# Altium project AKS.PrjPcb
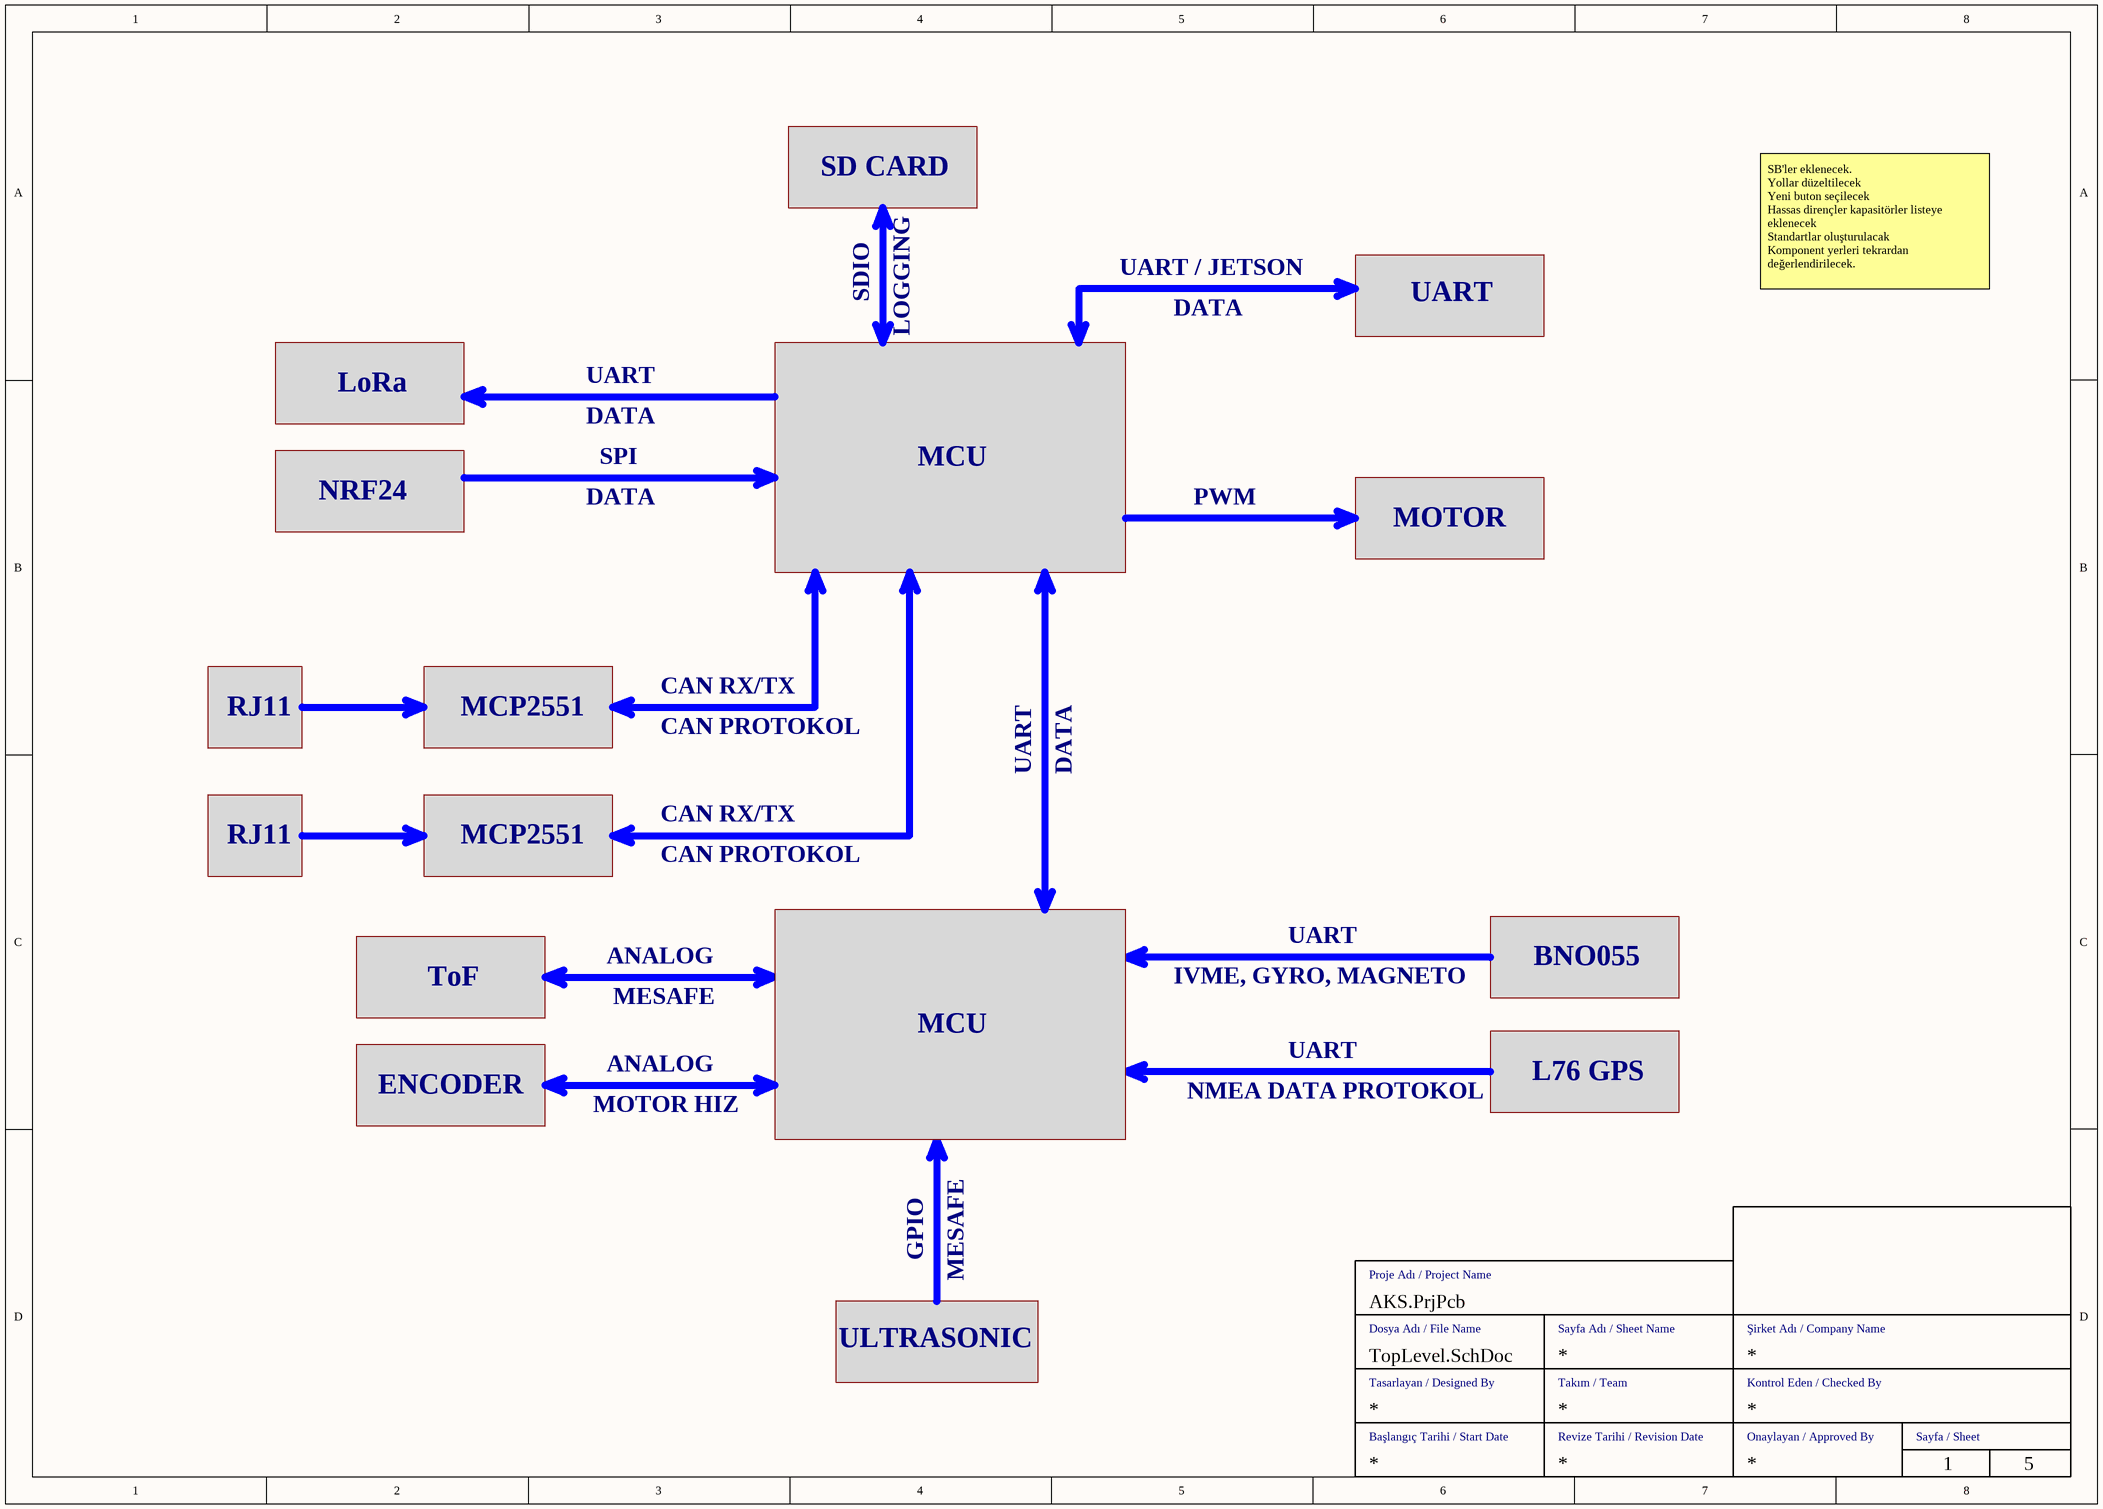
[diagram p0: TopLevel.SchDoc]
5 sheets, 106 parts. Net scope: flat (ports and power ports of the same name join across sheets).
Board file: AKS.PcbDoc
Sheets:
  TopLevel.SchDoc
  MCU.SchDoc
  Sensors.SchDoc
  Communication.SchDoc
  Power.SchDoc

## Sheet TopLevel.SchDoc
size A3; SheetNumber: 1; SheetTotal: 5

### Notes on the sheet
- SD CARD
- SDIO
- UART / JETSON
- DATA
- UART
- SB'ler eklenecek.
  Yollar düzeltilecek
  Yeni buton seçilecek
  Hassas dirençler kapasitörler listeye eklenecek
  Standartlar oluşturulacak
  Komponent yerleri tekrardan değerlendirilecek.
- LOGGING
- LoRa
- NRF24
- SPI
- MCU
- PWM
- MOTOR
- RJ11
- MCP2551
- CAN RX/TX
- CAN PROTOKOL
- ToF
- ANALOG
- IVME, GYRO, MAGNETO
- BNO055
- MESAFE
- ENCODER
- MOTOR HIZ
- NMEA DATA PROTOKOL
- L76 GPS
- GPIO
- ULTRASONIC
- Dosya Adı / File Name
- Proje Adı / Project Name
- Sayfa Adı / Sheet Name
- Şirket Adı / Company Name
- Tasarlayan / Designed By
- Takım / Team
- Kontrol Eden / Checked By
- Başlangıç Tarihi / Start Date
- Revize Tarihi / Revision Date
- Onaylayan / Approved By
- Sayfa / Sheet

## Sheet MCU.SchDoc
size A3; SheetNumber: 2; SheetTotal: 5
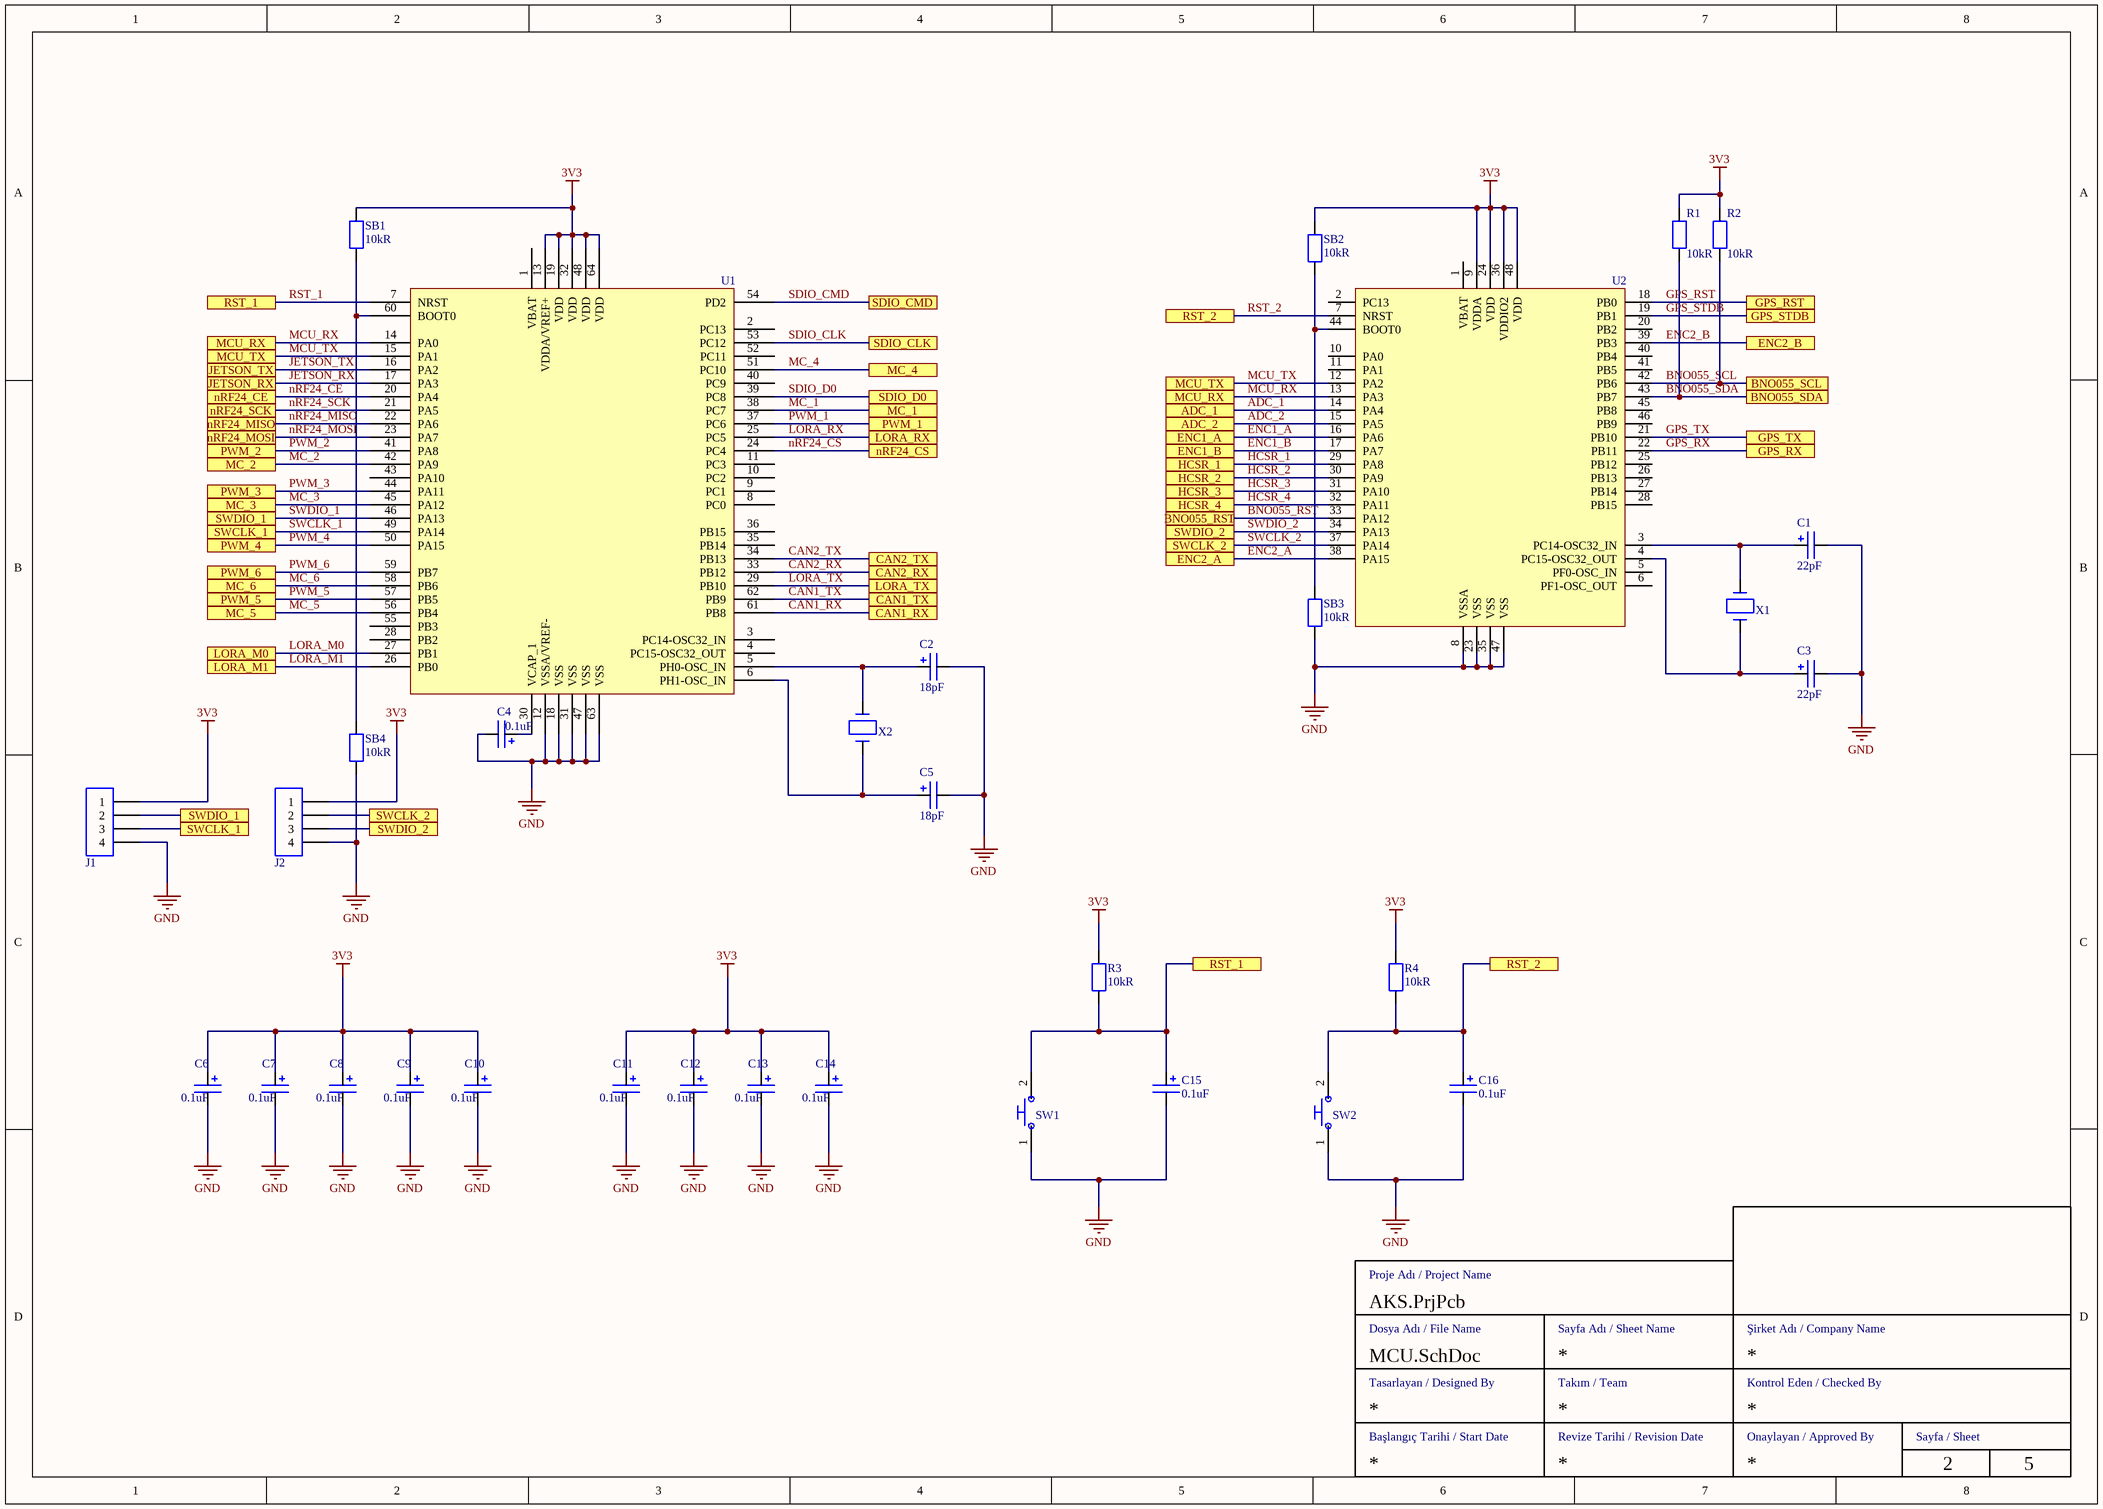
[diagram p1: MCU.SchDoc]

### Parts
C1  value 22pF  [CAP 0603]  (hidden comment: CAP 0603)
C2  value 18pF  [CAP 0603]  (hidden comment: CAP 0603)
C3  value 22pF  [CAP 0603]  (hidden comment: CAP 0603)
C4  value 0.1uF  [CAP 0603]  (hidden comment: CAP 0603)
C5  value 18pF  [CAP 0603]  (hidden comment: CAP 0603)
C6  value 0.1uF  [CAP 0603]  (hidden comment: CAP 0603)
C7  value 0.1uF  [CAP 0603]  (hidden comment: CAP 0603)
C8  value 0.1uF  [CAP 0603]  (hidden comment: CAP 0603)
C9  value 0.1uF  [CAP 0603]  (hidden comment: CAP 0603)
C10  value 0.1uF  [CAP 0603]  (hidden comment: CAP 0603)
C11  value 0.1uF  [CAP 0603]  (hidden comment: CAP 0603)
C12  value 0.1uF  [CAP 0603]  (hidden comment: CAP 0603)
C13  value 0.1uF  [CAP 0603]  (hidden comment: CAP 0603)
C14  value 0.1uF  [CAP 0603]  (hidden comment: CAP 0603)
C15  value 0.1uF  [CAP 0603]  (hidden comment: CAP 0603)
C16  value 0.1uF  [CAP 0603]  (hidden comment: CAP 0603)
J1  146285-4  [HMATHT00C41]  (value not drawn)
J2  146285-4  [HMATHT00C41]  (value not drawn)
R1  value 10kR  [RESISTOR 0603]  (hidden comment: RES 0603)
R2  value 10kR  [RESISTOR 0603]  (hidden comment: RES 0603)
R3  value 10kR  [RESISTOR 0603]  (hidden comment: RES 0603)
R4  value 10kR  [RESISTOR 0603]  (hidden comment: RES 0603)
SB1  value 10kR  [RESISTOR 0603]  (hidden comment: RES 0603)
SB2  value 10kR  [RESISTOR 0603]  (hidden comment: RES 0603)
SB3  value 10kR  [RESISTOR 0603]  (hidden comment: RES 0603)
SB4  value 10kR  [RESISTOR 0603]  (hidden comment: RES 0603)
SW1  DS1042-03  [SWITCH-6X6]  (value not drawn)
SW2  DS1042-03  [SWITCH-6X6]  (value not drawn)
U1  STM32F446xC  [LQFP64]  (value not drawn)
U2  STM32F072C8  [LQFP48]  (value not drawn)
X1  RSM200S-32.768  [4-SOJ]  (value not drawn)
X2  ABM3-8.000  [2-SMD]  (value not drawn)

### Ports
ADC_1, ADC_2, BNO055_RST, BNO055_SCL, BNO055_SDA, CAN1_RX, CAN1_TX, CAN2_RX, CAN2_TX, ENC1_A, ENC1_B, ENC2_A, ENC2_B, GPS_RST, GPS_RX, GPS_STDB, GPS_TX, HCSR_1, HCSR_2, HCSR_3, HCSR_4, JETSON_RX, JETSON_TX, LORA_M0, LORA_M1, LORA_RX, LORA_TX, MC_1, MC_2, MC_3, MC_4, MC_5, MC_6, MCU_RX, MCU_TX, nRF24_CE, nRF24_CS, nRF24_MISO, nRF24_MOSI, nRF24_SCK, PWM_1, PWM_2, PWM_3, PWM_4, PWM_5, PWM_6, RST_1, RST_2, SDIO_CLK, SDIO_CMD, SDIO_D0, SWCLK_1, SWCLK_2, SWDIO_1, SWDIO_2

### Nets
3V3: C6.1 C7.1 C8.1 C9.1 C10.1 C11.1 C12.1 C13.1 C14.1 J1.1 J2.1 R1.2 R2.2 R3.2 R4.2 SB1.2 SB2.2 U1.13(VDDA/VREF+) U1.19(VDD) U1.32(VDD) U1.48(VDD) U1.64(VDD) U2.9(VDDA) U2.24(VDD) U2.36(VDDIO2) U2.48(VDD)
GND: C1.2 C2.2 C3.2 C4.2 C5.2 C6.2 C7.2 C8.2 C9.2 C10.2 C11.2 C12.2 C13.2 C14.2 C15.2 C16.2 J1.4 J2.4 SB3.1 SB4.1 SW1.1 SW2.1 U1.12(VSSA/VREF-) U1.18(VSS) U1.31(VSS) U1.47(VSS) U1.63(VSS) U2.8(VSSA) U2.23(VSS) U2.35(VSS) U2.47(VSS)
ADC_1: U2.14(PA4) ; port ADC_1
ADC_2: U2.15(PA5) ; port ADC_2
BNO055_RST: U2.33(PA12) ; port BNO055_RST
BNO055_SCL: R2.1 U2.42(PB6) ; port BNO055_SCL
BNO055_SDA: R1.1 U2.43(PB7) ; port BNO055_SDA
CAN1_RX: U1.61(PB8) ; port CAN1_RX
CAN1_TX: U1.62(PB9) ; port CAN1_TX
CAN2_RX: U1.33(PB12) ; port CAN2_RX
CAN2_TX: U1.34(PB13) ; port CAN2_TX
ENC1_A: U2.16(PA6) ; port ENC1_A
ENC1_B: U2.17(PA7) ; port ENC1_B
ENC2_A: U2.38(PA15) ; port ENC2_A
ENC2_B: U2.39(PB3) ; port ENC2_B
GPS_RST: U2.18(PB0) ; port GPS_RST
GPS_RX: U2.22(PB11) ; port GPS_RX
GPS_STDB: U2.19(PB1) ; port GPS_STDB
GPS_TX: U2.21(PB10) ; port GPS_TX
HCSR_1: U2.29(PA8) ; port HCSR_1
HCSR_2: U2.30(PA9) ; port HCSR_2
HCSR_3: U2.31(PA10) ; port HCSR_3
HCSR_4: U2.32(PA11) ; port HCSR_4
JETSON_RX: U1.17(PA3) ; port JETSON_RX
JETSON_TX: U1.16(PA2) ; port JETSON_TX
LORA_M0: U1.27(PB1) ; port LORA_M0
LORA_M1: U1.26(PB0) ; port LORA_M1
LORA_RX: U1.25(PC5) ; port LORA_RX
LORA_TX: U1.29(PB10) ; port LORA_TX
MC_1: U1.38(PC7) ; port MC_1
MC_2: U1.42(PA9) ; port MC_2
MC_3: U1.45(PA12) ; port MC_3
MC_4: U1.51(PC10) ; port MC_4
MC_5: U1.56(PB4) ; port MC_5
MC_6: U1.58(PB6) ; port MC_6
MCU_RX: U1.14(PA0) U2.13(PA3) ; port MCU_RX
MCU_TX: U1.15(PA1) U2.12(PA2) ; port MCU_TX
nRF24_CE: U1.20(PA4) ; port nRF24_CE
nRF24_CS: U1.24(PC4) ; port nRF24_CS
nRF24_MISO: U1.22(PA6) ; port nRF24_MISO
nRF24_MOSI: U1.23(PA7) ; port nRF24_MOSI
nRF24_SCK: U1.21(PA5) ; port nRF24_SCK
PWM_1: U1.37(PC6) ; port PWM_1
PWM_2: U1.41(PA8) ; port PWM_2
PWM_3: U1.44(PA11) ; port PWM_3
PWM_4: U1.50(PA15) ; port PWM_4
PWM_5: U1.57(PB5) ; port PWM_5
PWM_6: U1.59(PB7) ; port PWM_6
RST_1: C15.1 R3.1 SW1.2 U1.7(NRST) ; port RST_1
RST_2: C16.1 R4.1 SW2.2 U2.7(NRST) ; port RST_2
SDIO_CLK: U1.53(PC12) ; port SDIO_CLK
SDIO_CMD: U1.54(PD2) ; port SDIO_CMD
SDIO_D0: U1.39(PC8) ; port SDIO_D0
SWCLK_1: J1.3 U1.49(PA14) ; port SWCLK_1
SWCLK_2: J2.2 U2.37(PA14) ; port SWCLK_2
SWDIO_1: J1.2 U1.46(PA13) ; port SWDIO_1
SWDIO_2: J2.3 U2.34(PA13) ; port SWDIO_2
NetC1_1: C1.1 U2.3(PC14-OSC32_IN) X1.1
NetC2_1: C2.1 U1.5(PH0-OSC_IN) X2.1
NetC3_1: C3.1 U2.4(PC15-OSC32_OUT) X1.4
NetC4_1: C4.1 U1.30(VCAP_1)
NetC5_1: C5.1 U1.6(PH1-OSC_IN) X2.2
NetSB1_1: SB1.1 SB4.2 U1.60(BOOT0)
NetSB2_1: SB2.1 SB3.2 U2.44(BOOT0)

Not connected (* = marked no-connect by the designer): U1 1(VBAT) 2(PC13) 3(PC14-OSC32_IN) 4(PC15-OSC32_OUT) 8(PC0) 9(PC1) 10(PC2) 11(PC3) 28(PB2) 35(PB14) 36(PB15) 40(PC9) 43(PA10) 52(PC11) 55(PB3); U2 1(VBAT) 2(PC13) 5(PF0-OSC_IN) 6(PF1-OSC_OUT) 10(PA0) 11(PA1) 20(PB2) 25(PB12) 26(PB13) 27(PB14) 28(PB15) 40(PB4) 41(PB5) 45(PB8) 46(PB9)

### Notes on the sheet
- Dosya Adı / File Name
- Proje Adı / Project Name
- Sayfa Adı / Sheet Name
- Şirket Adı / Company Name
- Tasarlayan / Designed By
- Takım / Team
- Kontrol Eden / Checked By
- Başlangıç Tarihi / Start Date
- Revize Tarihi / Revision Date
- Onaylayan / Approved By
- Sayfa / Sheet

### Library data of the parts
C1-C16 = CAP 0603: Multilayer Ceramic Capacitor; Capacitor Type: MLCC; Case/Package: 0603
J1 J2 = HMATHT00C41: Header for PCB
R1-R4 SB1-SB4 = RES 0603: SMD Chip Resistor; Case/Package: 0603
SW1 SW2 = DS1042-03: Switch
U1 = STM32F446xC: STM32 ARM Cortex M4; Case/Package: LQFP; Pins: 64; Category: MCU
U2 = STM32F072C8: STM32 ARM Cortex M0; Case/Package: LQFP; Pins: 48; Category: MCU
X1 = RSM200S-32.768: CRYSTAL; Capacitance: 12.5pF
X2 = ABM3-8.000: CRYSTAL; Frequency: 8MHz; Capacitance: 18pF; Case/Package: 2-SMD

## Sheet Sensors.SchDoc
size A4; SheetNumber: 3; SheetTotal: 5
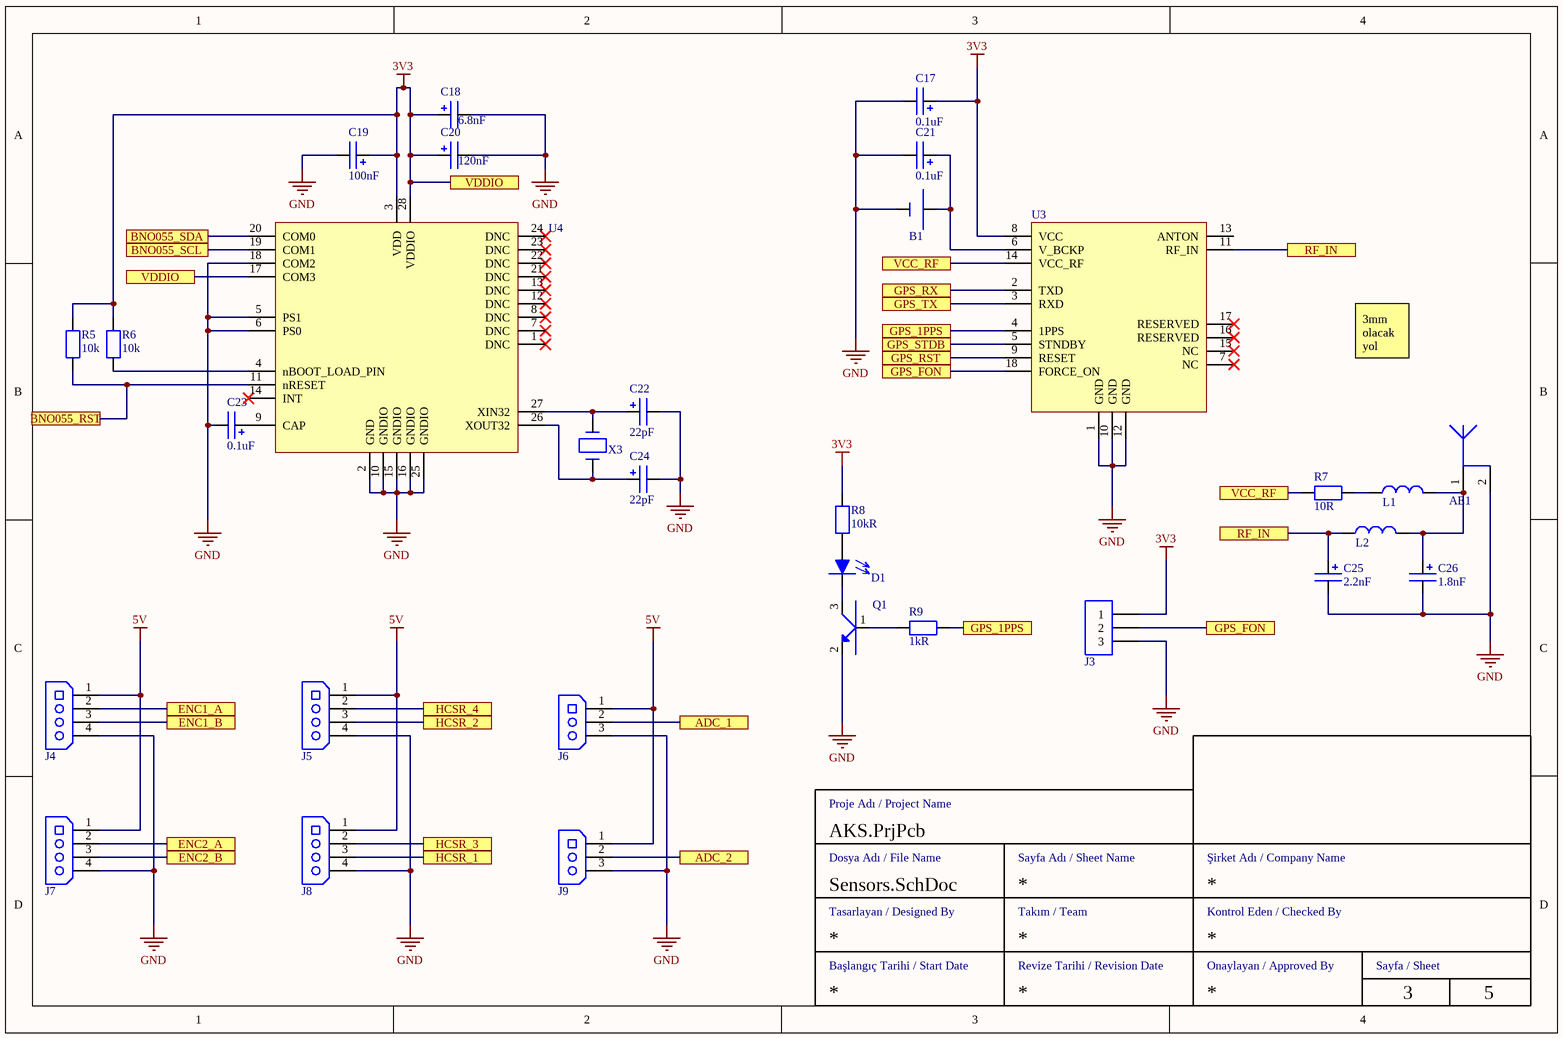
[diagram p2: Sensors.SchDoc]

### Parts
AE1  UFL Connector  [UFL CONN]  (value not drawn)
B1  BH029  [BH029]  (value not drawn)
C17  value 0.1uF  [CAP 0603]  (hidden comment: CAP 0603)
C18  value 6.8nF  [CAP 0603]  (hidden comment: CAP 0603)
C19  value 100nF  [CAP 0603]  (hidden comment: CAP 0603)
C20  value 120nF  [CAP 0603]  (hidden comment: CAP 0603)
C21  value 0.1uF  [CAP 0603]  (hidden comment: CAP 0603)
C22  value 22pF  [CAP 0603]  (hidden comment: CAP 0603)
C23  value 0.1uF  [CAP 0603]  (hidden comment: CAP 0603)
C24  value 22pF  [CAP 0603]  (hidden comment: CAP 0603)
C25  value 2.2nF  [CAP 0603]  (hidden comment: CAP 0603)
C26  value 1.8nF  [CAP 0603]  (hidden comment: CAP 0603)
D1  LTW-C191TLA  [LED 0603]  (value not drawn)
J3  146285-3  [HMATHT00C31]  (value not drawn)
J4  JSTXH4  [JSTXH4]  (value not drawn)
J5  JSTXH4  [JSTXH4]  (value not drawn)
J6  JSTXH3  [JSTXH3]  (value not drawn)
J7  JSTXH4  [JSTXH4]  (value not drawn)
J8  JSTXH4  [JSTXH4]  (value not drawn)
J9  JSTXH3  [JSTXH3]  (value not drawn)
L1  IND 0603  [INDUCTOR 0603]  (value not drawn)
L2  IND 0603  [INDUCTOR 0603]  (value not drawn)
Q1  BC817-40  [SOT23-3]  (value not drawn)
R5  value 10k  [RESISTOR 0603]  (hidden comment: RES 0603)
R6  value 10k  [RESISTOR 0603]  (hidden comment: RES 0603)
R7  value 10R  [RESISTOR 0603]  (hidden comment: RES 0603)
R8  value 10kR  [RESISTOR 0603]  (hidden comment: RES 0603)
R9  value 1kR  [RESISTOR 0603]  (hidden comment: RES 0603)
U3  L76M33  [L76M33]  (value not drawn)
U4  BNO055  [LGA-28]  (value not drawn)
X3  RSM200S-32.768  [4-SOJ]  (value not drawn)

### Ports
ADC_1, ADC_2, BNO055_RST, BNO055_SCL, BNO055_SDA, ENC1_A, ENC1_B, ENC2_A, ENC2_B, GPS_1PPS, GPS_FON, GPS_RST, GPS_RX, GPS_STDB, GPS_TX, HCSR_1, HCSR_2, HCSR_3, HCSR_4, RF_IN, VCC_RF, VDDIO

### Nets
3V3: C17.1 C18.1 C19.1 C20.1 J3.1 R5.2 R6.2 R8.2 U3.8(VCC) U4.3(VDD) U4.17(COM3) U4.28(VDDIO) ; port VDDIO
5V: J4.1 J5.1 J6.1 J7.1 J8.1 J9.1
GND: AE1.2 B1.2 C17.2 C18.2 C19.2 C20.2 C21.2 C22.2 C23.2 C24.2 C25.2 C26.2 J3.3 J4.4 J5.4 J6.3 J7.4 J8.4 J9.3 Q1.2(S) U3.1(GND) U3.10(GND) U3.12(GND) U4.2(GND) U4.5(PS1) U4.6(PS0) U4.10(GNDIO) U4.15(GNDIO) U4.16(GNDIO) U4.18(COM2) U4.25(GNDIO)
ADC_1: J6.2 ; port ADC_1
ADC_2: J9.2 ; port ADC_2
BNO055_RST: R5.1 U4.11(nRESET) ; port BNO055_RST
BNO055_SCL: U4.19(COM1) ; port BNO055_SCL
BNO055_SDA: U4.20(COM0) ; port BNO055_SDA
ENC1_A: J4.2 ; port ENC1_A
ENC1_B: J4.3 ; port ENC1_B
ENC2_A: J7.2 ; port ENC2_A
ENC2_B: J7.3 ; port ENC2_B
GPS_RST: U3.9(RESET) ; port GPS_RST
GPS_RX: U3.2(TXD) ; port GPS_RX
GPS_STDB: U3.5(STNDBY) ; port GPS_STDB
GPS_TX: U3.3(RXD) ; port GPS_TX
HCSR_1: J8.3 ; port HCSR_1
HCSR_2: J5.3 ; port HCSR_2
HCSR_3: J8.2 ; port HCSR_3
HCSR_4: J5.2 ; port HCSR_4
NetAE1_1: AE1.1 C26.1 L1.2 L2.2
NetB1_1: B1.1 C21.1 U3.6(V_BCKP)
NetC22_1: C22.1 U4.27(XIN32) X3.4
NetC23_1: C23.1 U4.9(CAP)
NetC24_1: C24.1 U4.26(XOUT32) X3.1
NetC25_1: C25.1 L2.1 U3.11(RF_IN) ; port RF_IN
NetD1_1: D1.1 Q1.3(D)
NetD1_2: D1.2 R8.1
NetJ3_2: J3.2 U3.18(FORCE_ON) ; port GPS_FON
NetL1_1: L1.1 R7.2
NetQ1_1: Q1.1(G) R9.1
NetR6_1: R6.1 U4.4(nBOOT_LOAD_PIN)
NetR7_1: R7.1 U3.14(VCC_RF) ; port VCC_RF
NetR9_2: R9.2 U3.4(1PPS) ; port GPS_1PPS

Not connected (* = marked no-connect by the designer): U3 7(NC)* 13(ANTON) 15(NC)* 16(RESERVED)* 17(RESERVED)*; U4 1(DNC)* 7(DNC)* 8(DNC)* 12(DNC)* 13(DNC)* 14(INT)* 21(DNC)* 22(DNC)* 23(DNC)* 24(DNC)*

### Notes on the sheet
- 3mm olacak yol
- Dosya Adı / File Name
- Proje Adı / Project Name
- Sayfa Adı / Sheet Name
- Şirket Adı / Company Name
- Tasarlayan / Designed By
- Takım / Team
- Kontrol Eden / Checked By
- Başlangıç Tarihi / Start Date
- Revize Tarihi / Revision Date
- Onaylayan / Approved By
- Sayfa / Sheet

### Library data of the parts
AE1 = UFL Connector: Antenna Connector
B1 = BH029: Battery Holder; Category: Battery Holder
C17-C26 = CAP 0603: as C1 on sheet MCU; Case/Package: 0603
D1 = LED 0603: Chip LED; Case/Package: 0603
J3 = HMATHT00C31: Header for PCB
J4 J5 J7 J8 = JSTXH4: JST Socket for PCB
J6 J9 = JSTXH3: JST Socket for PCB
L1 L2 = IND 0603: SMD Inductor
Q1 = BC817-40: Transistor BJT; Transistor Type: NPN; Voltage: 45V; Current: 500mA; Case/Package: SOT23
R5-R9 = RES 0603: SMD Chip Resistor; Case/Package: 0603
U3 = L76M33: GPS, GLONASS, GNSS Transceiver
U4 = BNO055: IMU Sensor; Case/Package: LGA28; Category: Sensor
X3 = RSM200S-32.768: CRYSTAL; Capacitance: 12.5pF

## Sheet Communication.SchDoc
size A4; SheetNumber: 4; SheetTotal: 5
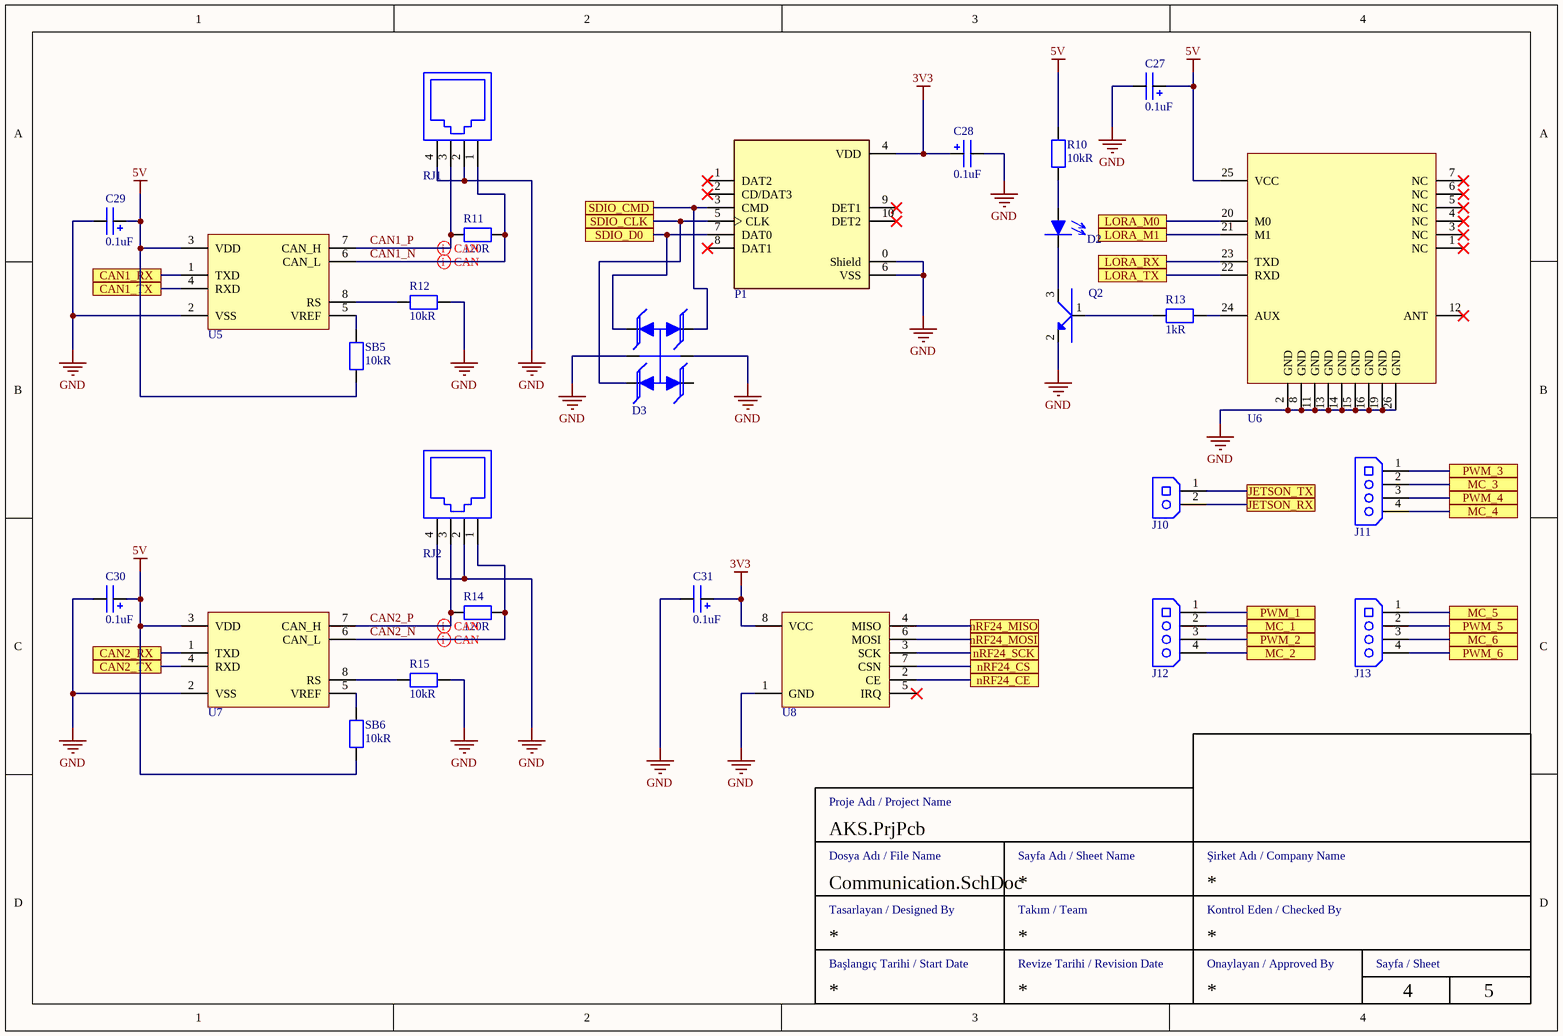
[diagram p3: Communication.SchDoc]

### Parts
C27  value 0.1uF  [CAP 0603]  (hidden comment: CAP 0603)
C28  value 0.1uF  [CAP 0603]  (hidden comment: CAP 0603)
C29  value 0.1uF  [CAP 0603]  (hidden comment: CAP 0603)
C30  value 0.1uF  [CAP 0603]  (hidden comment: CAP 0603)
C31  value 0.1uF  [CAP 0603]  (hidden comment: CAP 0603)
D2  LTW-C191TLA  [LED 0603]  (value not drawn)
D3  ESDA6V1SC6  [SOT23-6]  (value not drawn)
J10  JSTXH2  [JSTXH2]  (value not drawn)
J11  JSTXH4  [JSTXH4]  (value not drawn)
J12  JSTXH4  [JSTXH4]  (value not drawn)
J13  JSTXH4  [JSTXH4]  (value not drawn)
P1  DM3AT-SF-PEJM5  [SD CARD (8+2)]  (value not drawn)
Q2  BC817-40  [SOT23-3]  (value not drawn)
R10  value 10kR  [RESISTOR 0603]  (hidden comment: RES 0603)
R11  value 120R  [RESISTOR 0603]  (hidden comment: RES 0603)
R12  value 10kR  [RESISTOR 0603]  (hidden comment: RES 0603)
R13  value 1kR  [RESISTOR 0603]  (hidden comment: RES 0603)
R14  value 120R  [RESISTOR 0603]  (hidden comment: RES 0603)
R15  value 10kR  [RESISTOR 0603]  (hidden comment: RES 0603)
RJ1  DS1133-03-S60BX  [RJ6P4C]  (value not drawn)
RJ2  DS1133-03-S60BX  [RJ6P4C]  (value not drawn)
SB5  value 10kR  [RESISTOR 0603]  (hidden comment: RES 0603)
SB6  value 10kR  [RESISTOR 0603]  (hidden comment: RES 0603)
U5  MCP2551T-I  [SOIC-8]  (value not drawn)
U6  E220-400  [E220-400T22S]  (value not drawn)
U7  MCP2551T-I  [SOIC-8]  (value not drawn)
U8  NRF24  [nRF24L01+]  (value not drawn)

### Ports
CAN1_RX, CAN1_TX, CAN2_RX, CAN2_TX, JETSON_RX, JETSON_TX, LORA_M0, LORA_M1, LORA_RX, LORA_TX, MC_1, MC_2, MC_3, MC_4, MC_5, MC_6, nRF24_CE, nRF24_CS, nRF24_MISO, nRF24_MOSI, nRF24_SCK, PWM_1, PWM_2, PWM_3, PWM_4, PWM_5, PWM_6, SDIO_CLK, SDIO_CMD, SDIO_D0

### Nets
3V3: C28.1 C31.1 P1.4(VDD) U8.8(VCC)
5V: C27.1 C29.1 C30.1 R10.2 SB5.1 SB6.1 U5.3(VDD) U6.25(VCC) U7.3(VDD)
GND: C27.2 C28.2 C29.2 C30.2 C31.2 D3.2 D3.5 P1.0(Shield) P1.6(VSS) Q2.2(S) R12.2 R15.2 RJ1.2 RJ1.4 RJ2.2 RJ2.4 U5.2(VSS) U6.2(GND) U6.8(GND) U6.11(GND) U6.13(GND) U6.14(GND) U6.15(GND) U6.16(GND) U6.19(GND) U6.26(GND) U7.2(VSS) U8.1(GND)
CAN1_N: R11.1 RJ1.1 U5.6(CAN_L)
CAN1_P: R11.2 RJ1.3 U5.7(CAN_H)
CAN1_RX: U5.1(TXD) ; port CAN1_RX
CAN1_TX: U5.4(RXD) ; port CAN1_TX
CAN2_N: R14.1 RJ2.1 U7.6(CAN_L)
CAN2_P: R14.2 RJ2.3 U7.7(CAN_H)
CAN2_RX: U7.1(TXD) ; port CAN2_RX
CAN2_TX: U7.4(RXD) ; port CAN2_TX
JETSON_RX: J10.2 ; port JETSON_RX
JETSON_TX: J10.1 ; port JETSON_TX
LORA_M0: U6.20(M0) ; port LORA_M0
LORA_M1: U6.21(M1) ; port LORA_M1
LORA_RX: U6.23(TXD) ; port LORA_RX
LORA_TX: U6.22(RXD) ; port LORA_TX
MC_1: J12.2 ; port MC_1
MC_2: J12.4 ; port MC_2
MC_3: J11.2 ; port MC_3
MC_4: J11.4 ; port MC_4
MC_5: J13.1 ; port MC_5
MC_6: J13.3 ; port MC_6
nRF24_CE: U8.2(CE) ; port nRF24_CE
nRF24_CS: U8.7(CSN) ; port nRF24_CS
nRF24_MISO: U8.4(MISO) ; port nRF24_MISO
nRF24_MOSI: U8.6(MOSI) ; port nRF24_MOSI
nRF24_SCK: U8.3(SCK) ; port nRF24_SCK
PWM_1: J12.1 ; port PWM_1
PWM_2: J12.3 ; port PWM_2
PWM_3: J11.1 ; port PWM_3
PWM_4: J11.3 ; port PWM_4
PWM_5: J13.2 ; port PWM_5
PWM_6: J13.4 ; port PWM_6
SDIO_CLK: D3.6 P1.5(CLK) ; port SDIO_CLK
SDIO_CMD: D3.3 P1.3(CMD) ; port SDIO_CMD
SDIO_D0: D3.4 P1.7(DAT0) ; port SDIO_D0
NetD2_1: D2.1 Q2.3(D)
NetD2_2: D2.2 R10.1
NetQ2_1: Q2.1(G) R13.1
NetR12_1: R12.1 U5.8(RS)
NetR13_2: R13.2 U6.24(AUX)
NetR15_1: R15.1 U7.8(RS)
NetSB5_2: SB5.2 U5.5(VREF)
NetSB6_2: SB6.2 U7.5(VREF)

Not connected (* = marked no-connect by the designer): D3 1; P1 1(DAT2)* 2(CD/DAT3)* 8(DAT1)* 9(DET1)* 10(DET2)*; U6 1(NC)* 3(NC)* 4(NC)* 5(NC)* 6(NC)* 7(NC)* 12(ANT)*; U8 5(IRQ)*

### Layout directives
differential pair: CAN1_N, CAN1_P, CAN2_N, CAN2_P

### Notes on the sheet
- Dosya Adı / File Name
- Proje Adı / Project Name
- Sayfa Adı / Sheet Name
- Şirket Adı / Company Name
- Tasarlayan / Designed By
- Takım / Team
- Kontrol Eden / Checked By
- Başlangıç Tarihi / Start Date
- Revize Tarihi / Revision Date
- Onaylayan / Approved By
- Sayfa / Sheet

### Library data of the parts
C27-C31 = CAP 0603: as C1 on sheet MCU; Case/Package: 0603
D2 = LED 0603: Chip LED; Case/Package: 0603
D3 = ESDA6V1SC6: Diode TVS Array; Voltage: 5.25V; Case/Package: SOT23; Diode Type: TVS Array
J10 = JSTXH2: JST Socket for PCB
J11-J13 = JSTXH4: JST Socket for PCB
P1 = DM3AT-SF-PEJM5: Micro SD Card Adapter
Q2 = BC817-40: as Q1 on sheet Sensors; Case/Package: SOT23
R10-R15 SB5 SB6 = RES 0603: SMD Chip Resistor; Case/Package: 0603
RJ1 RJ2 = RJ11: RJ11 Jack; Positions/Contacts: 6P/4C; RJ Type: RJ11
U5 U7 = MCP2551T-I: CAN Transceiver; Category: Interface IC; Case/Package: SOIC-8
U6 = E220-400: RF Transceiver; Frequency: 433MHz; Category: Wireless Comm
U8 = NRF24: RF Transceiver; Frequency: 2.4GHz; Category: Wireless Comm

## Sheet Power.SchDoc
size A4; SheetNumber: 5; SheetTotal: 5
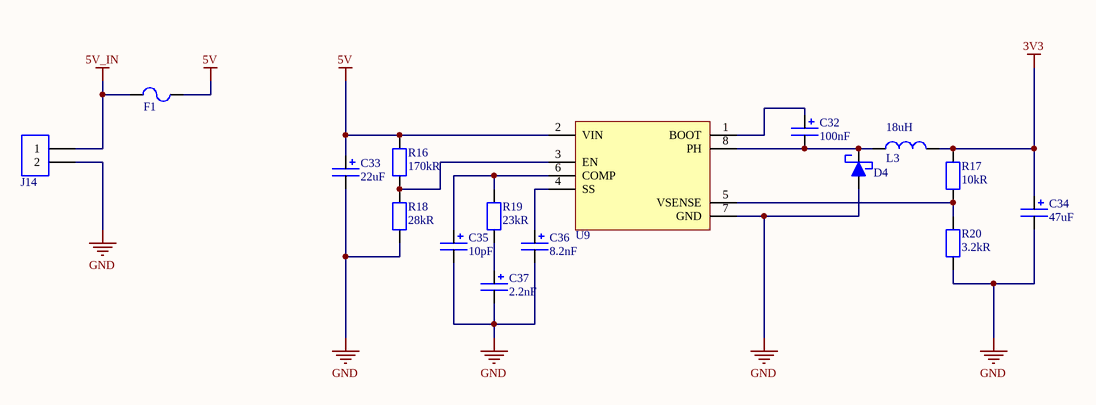
[diagram p4: Power.SchDoc]

### Parts
C32  value 100nF  [CAP 0603]  (hidden comment: CAP 0603)
C33  value 22uF  [CAP 0603]  (hidden comment: CAP 0603)
C34  value 47uF  [CAP 0603]  (hidden comment: CAP 0603)
C35  value 10pF  [CAP 0603]  (hidden comment: CAP 0603)
C36  value 8.2nF  [CAP 0603]  (hidden comment: CAP 0603)
C37  value 2.2nF  [CAP 0603]  (hidden comment: CAP 0603)
D4  1N5819HW-7-F  [SOD123]  (value not drawn)
F1  PTC 1206  [PTC 1206]  (value not drawn)
J14  282845-2  [TERM-21]  (value not drawn)
L3  value 18uH  [IND 6X6]  (hidden comment: NR6028)
R16  value 170kR  [RESISTOR 0603]  (hidden comment: RES 0603)
R17  value 10kR  [RESISTOR 0603]  (hidden comment: RES 0603)
R18  value 28kR  [RESISTOR 0603]  (hidden comment: RES 0603)
R19  value 23kR  [RESISTOR 0603]  (hidden comment: RES 0603)
R20  value 3.2kR  [RESISTOR 0603]  (hidden comment: RES 0603)
U9  TPS54231  [SOIC-8]  (value not drawn)

### Nets
3V3: C34.1 L3.2 R17.2
5V: C33.1 F1.2 R16.2 U9.2(VIN)
5V_IN: F1.1 J14.1
GND: C33.2 C34.2 C35.2 C36.2 C37.2 D4.2 J14.2 R18.1 R20.1 U9.7(GND)
NetC32_1: C32.1 U9.1(BOOT)
NetC32_2: C32.2 D4.1 L3.1 U9.8(PH)
NetC35_1: C35.1 R19.2 U9.6(COMP)
NetC36_1: C36.1 U9.4(SS)
NetC37_1: C37.1 R19.1
NetR16_1: R16.1 R18.2 U9.3(EN)
NetR17_1: R17.1 R20.2 U9.5(VSENSE)

### Notes on the sheet
- Dosya Adı / File Name
- Proje Adı / Project Name
- Sayfa Adı / Sheet Name
- Şirket Adı / Company Name
- Tasarlayan / Designed By
- Takım / Team
- Kontrol Eden / Checked By
- Başlangıç Tarihi / Start Date
- Revize Tarihi / Revision Date
- Onaylayan / Approved By
- Sayfa / Sheet

### Library data of the parts
C32-C37 = CAP 0603: as C1 on sheet MCU; Case/Package: 0603
D4 = 1N5819HW-7-F: Diode Schottky; Voltage: 40V; Case/Package: SOD-123; Diode Type: Schottky
F1 = PTC 1206: Fuse
J14 = TERM-21: Screw Terminal; Pin Rows: 1; Pitch: 7.62mm
L3 = NR6028: SMD Inductor
R16-R20 = RES 0603: SMD Chip Resistor; Case/Package: 0603
U9 = TPS54231: Regulator Switch

## Nets that join several sheets
3V3: MCU (26 pins), Sensors (12 pins), Communication (C28.1 C31.1 P1.4 U8.8), Power (C34.1 L3.2 R17.2)
5V: Sensors (6 pins), Communication (9 pins), Power (C33.1 F1.2 R16.2 U9.2)
GND: MCU (31 pins), Sensors (31 pins), Communication (28 pins), Power (10 pins)
ADC_1: MCU (U2.14), Sensors (J6.2)
ADC_2: MCU (U2.15), Sensors (J9.2)
BNO055_RST: MCU (U2.33), Sensors (R5.1 U4.11)
BNO055_SCL: MCU (R2.1 U2.42), Sensors (U4.19)
BNO055_SDA: MCU (R1.1 U2.43), Sensors (U4.20)
CAN1_RX: MCU (U1.61), Communication (U5.1)
CAN1_TX: MCU (U1.62), Communication (U5.4)
CAN2_RX: MCU (U1.33), Communication (U7.1)
CAN2_TX: MCU (U1.34), Communication (U7.4)
ENC1_A: MCU (U2.16), Sensors (J4.2)
ENC1_B: MCU (U2.17), Sensors (J4.3)
ENC2_A: MCU (U2.38), Sensors (J7.2)
ENC2_B: MCU (U2.39), Sensors (J7.3)
GPS_RST: MCU (U2.18), Sensors (U3.9)
GPS_RX: MCU (U2.22), Sensors (U3.2)
GPS_STDB: MCU (U2.19), Sensors (U3.5)
GPS_TX: MCU (U2.21), Sensors (U3.3)
HCSR_1: MCU (U2.29), Sensors (J8.3)
HCSR_2: MCU (U2.30), Sensors (J5.3)
HCSR_3: MCU (U2.31), Sensors (J8.2)
HCSR_4: MCU (U2.32), Sensors (J5.2)
JETSON_RX: MCU (U1.17), Communication (J10.2)
JETSON_TX: MCU (U1.16), Communication (J10.1)
LORA_M0: MCU (U1.27), Communication (U6.20)
LORA_M1: MCU (U1.26), Communication (U6.21)
LORA_RX: MCU (U1.25), Communication (U6.23)
LORA_TX: MCU (U1.29), Communication (U6.22)
MC_1: MCU (U1.38), Communication (J12.2)
MC_2: MCU (U1.42), Communication (J12.4)
MC_3: MCU (U1.45), Communication (J11.2)
MC_4: MCU (U1.51), Communication (J11.4)
MC_5: MCU (U1.56), Communication (J13.1)
MC_6: MCU (U1.58), Communication (J13.3)
nRF24_CE: MCU (U1.20), Communication (U8.2)
nRF24_CS: MCU (U1.24), Communication (U8.7)
nRF24_MISO: MCU (U1.22), Communication (U8.4)
nRF24_MOSI: MCU (U1.23), Communication (U8.6)
nRF24_SCK: MCU (U1.21), Communication (U8.3)
PWM_1: MCU (U1.37), Communication (J12.1)
PWM_2: MCU (U1.41), Communication (J12.3)
PWM_3: MCU (U1.44), Communication (J11.1)
PWM_4: MCU (U1.50), Communication (J11.3)
PWM_5: MCU (U1.57), Communication (J13.2)
PWM_6: MCU (U1.59), Communication (J13.4)
SDIO_CLK: MCU (U1.53), Communication (D3.6 P1.5)
SDIO_CMD: MCU (U1.54), Communication (D3.3 P1.3)
SDIO_D0: MCU (U1.39), Communication (D3.4 P1.7)